# EAGLE design 0.1 (EAGLE 6.6.0)
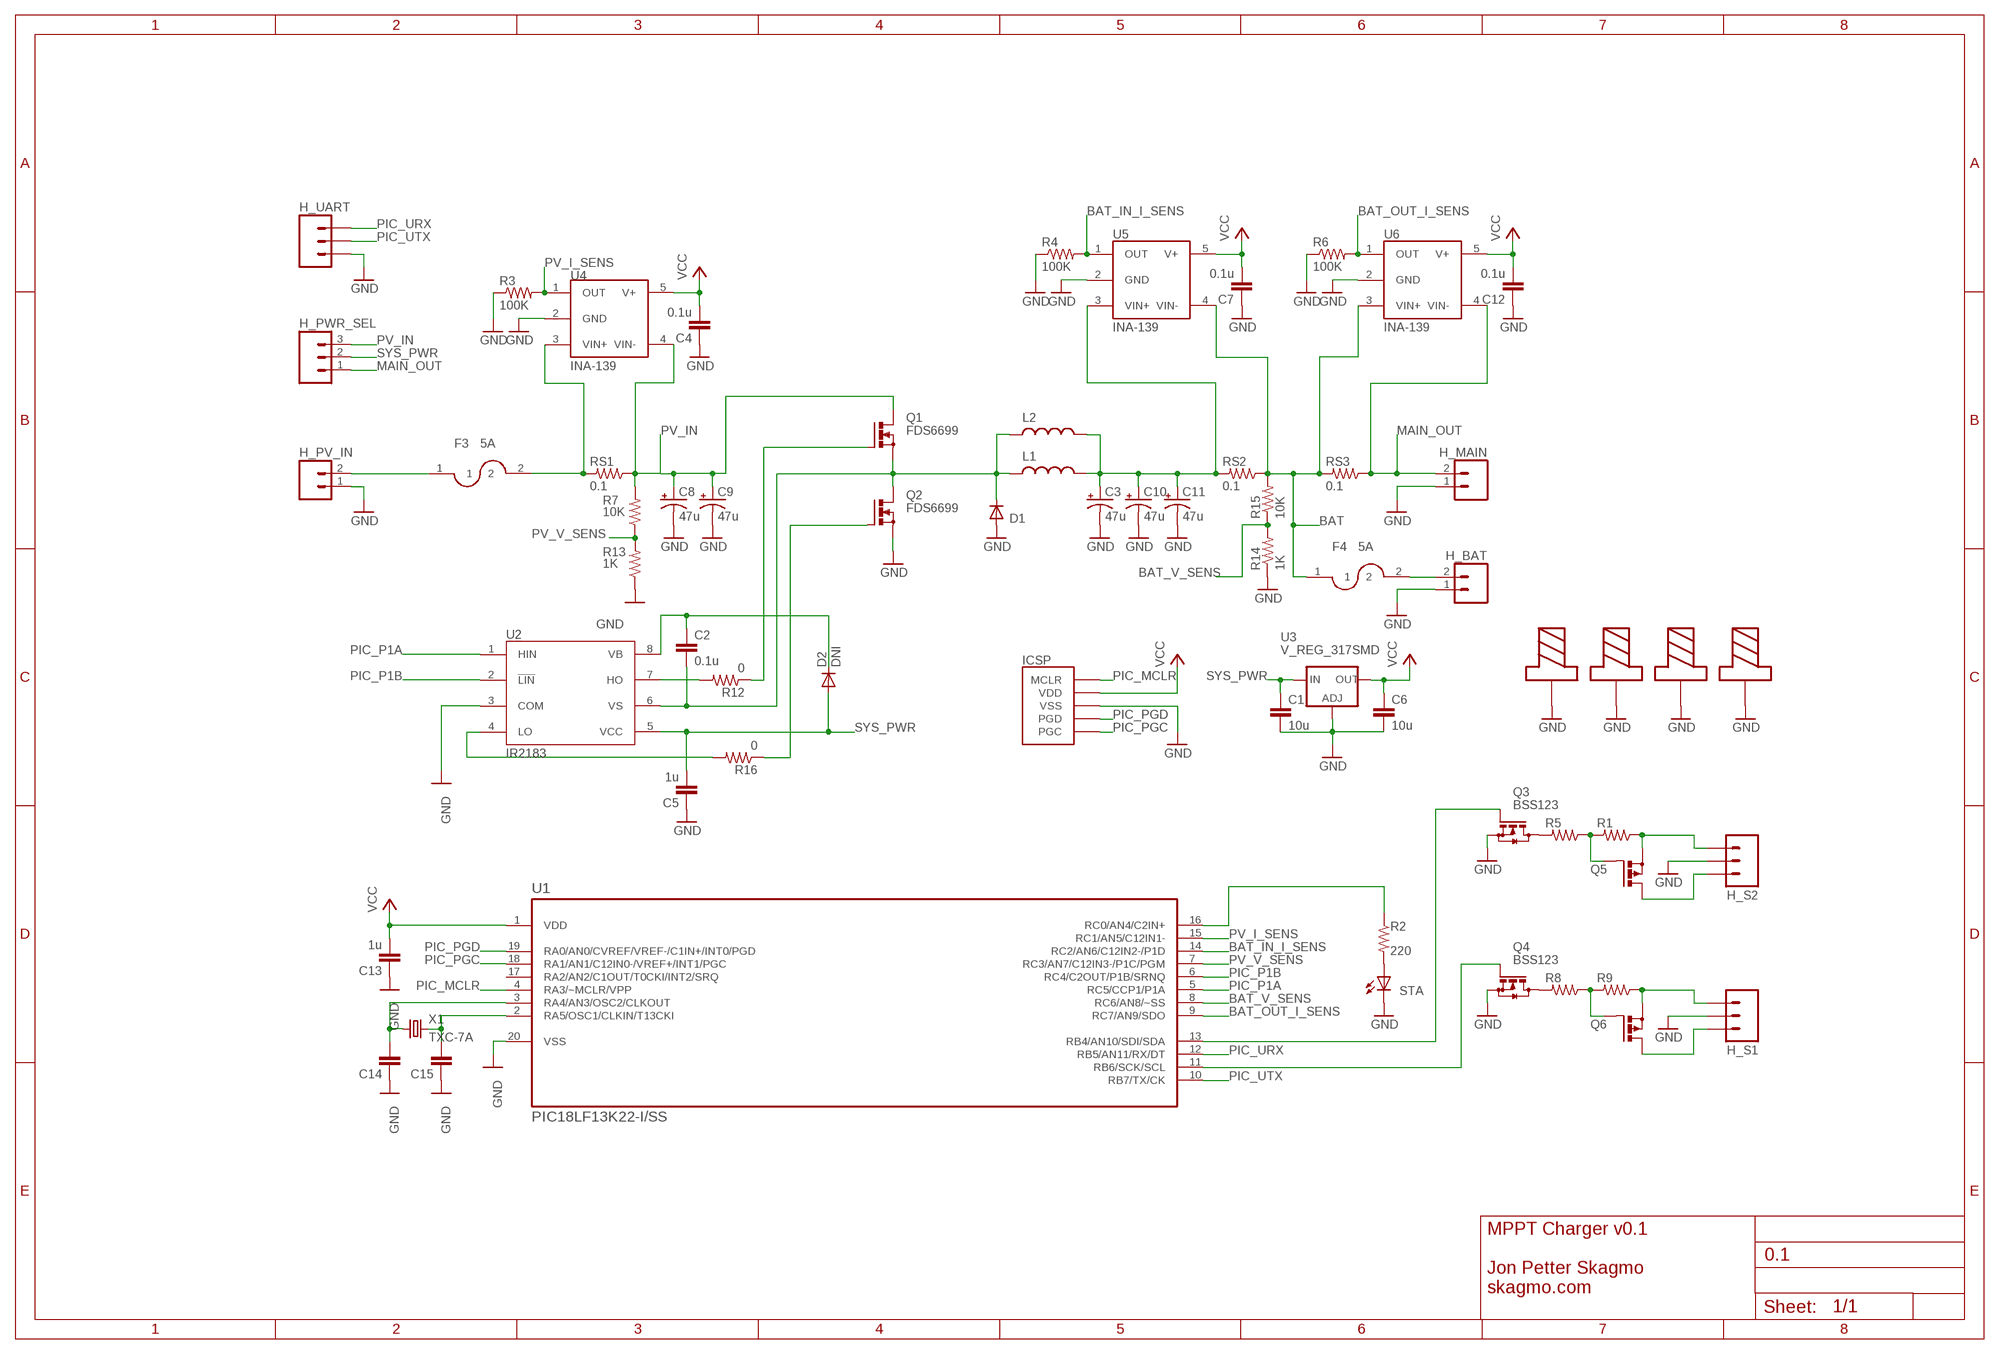
[diagram p0: schematic, sheet 1]

## Parts
C1  10u  C-EUC0805K  [C0805K]
C2  0.1u  CAP0603  [0603]
C3  47u  CAP_POLCT7343  [CT7343]
C4  0.1u  CAP0603  [0603]
C5  1u  CAP0603  [0603]
C6  10u  C-EUC0805K  [C0805K]
C7  0.1u  CAP0603  [0603]
C8  47u  CAP_POLCT7343  [CT7343]
C9  47u  CAP_POLCT7343  [CT7343]
C10  47u  CAP_POLCT7343  [CT7343]
C11  47u  CAP_POLCT7343  [CT7343]
C12  0.1u  CAP0603  [0603]
C13  1u  CAP0603  [0603]
C14  CAP0603  [0603]
C15  CAP0603  [0603]
D1  DIODESMB  [SMB-DIODE]
D2  DNI  DIODESOD  [SOD-323]
F3  5A  FUSE1206  [1206]
F4  5A  FUSE1206  [1206]
H_BAT  M023.5MM  [SCREWTERMINAL-3.5MM-2]
H_MAIN  M023.5MM  [SCREWTERMINAL-3.5MM-2]
H_PV_IN  M023.5MM  [SCREWTERMINAL-3.5MM-2]
H_PWR_SEL  M03PTH  [1X03]
H_S1  1X3SCREW  [1X3_SCREW_0.1]
H_S2  1X3SCREW  [1X3_SCREW_0.1]
H_UART  1X3SCREW  [1X3_SCREW_0.1]
ICSP  1X5_ICSP  [1X5_2MM]
L1  INDUCTORIHLP-6767  [IHLP-6767]
L2  INDUCTORIHLP-4040  [IHLP-4040]
Q1  FDS6699  PMOSFET_N  [SO08]
Q2  FDS6699  PMOSFET_N  [SO08]
Q3  BSS123  [SOT23]
Q4  BSS123  [SOT23]
Q5  PMOSFET_P  [SO08]
Q6  PMOSFET_P  [SO08]
R1  RESISTOR0603  [0603]
R2  220  RESISTOR0603  [0603]
R3  100K  RESISTOR0603  [0603]
R4  100K  RESISTOR0603  [0603]
R5  RESISTOR0603  [0603]
R6  100K  RESISTOR0603  [0603]
R7  10K  RESISTOR0603  [0603]
R8  RESISTOR0603  [0603]
R9  RESISTOR0603  [0603]
R12  0  RESISTOR0603  [0603]
R13  1K  RESISTOR0603  [0603]
R14  1K  RESISTOR0603  [0603]
R15  10K  RESISTOR0603  [0603]
R16  0  RESISTOR0603  [0603]
RS1  0.1  RESISTOR1206  [1206]
RS2  0.1  RESISTOR1206  [1206]
RS3  0.1  RESISTOR1206  [1206]
STA  LEDCHIPLED_0805  [CHIPLED_0805]
U1  PIC18LF13K22-I/SS  [SOP65P780X200-20N]
U2  IR2183  [SO08]
U3  V_REG_317SMD  [SOT223]
U4  INA-139  INA-169  [SOT23-5]
U5  INA-139  INA-169  [SOT23-5]
U6  INA-139  INA-169  [SOT23-5]
U$1  CORNER_SCREW  [CORNER_SCREW]
U$2  CORNER_SCREW  [CORNER_SCREW]
U$3  CORNER_SCREW  [CORNER_SCREW]
U$4  CORNER_SCREW  [CORNER_SCREW]
X1  TXC-7A  [TXC-7A]

## Nets
$N100: F3.1 H_PV_IN.2
$N145: F3.2 RS1.2 U4.3(VIN+)
BAT: F4.1 R15.2 RS2.1 RS3.2 U5.4(VIN-) U6.3(VIN+)
BAT_IN_I_SENS: R4.2 U1.14(RC2/AN6/C12IN2-/P1D) U5.1(OUT)
BAT_OUT_I_SENS: R6.2 U1.9(RC7/AN9/SDO) U6.1(OUT)
BAT_V_SENS: R14.2 R15.1 U1.8(RC6/AN8/~SS)
GND: C1.2 C3.- C4.1 C5.1 C6.2 C7.1 C8.- C9.- C10.- C11.- C12.1 C13.1 C14.1 C15.1 D1.A H_BAT.1 H_MAIN.1 H_PV_IN.1 H_S1.P$2 H_S2.P$2 H_UART.P$1 ICSP.P$3(VSS) Q2.1(S) Q2.2(S) Q2.3(S) Q3.2(S) Q4.2(S) R3.1 R4.1 R6.1 R13.1 R14.1 STA.C U1.20(VSS) U2.3(COM) U3.1(ADJ) U4.2(GND) U5.2(GND) U6.2(GND) U$1.P$1 U$2.P$1 U$3.P$1 U$4.P$1
MAIN_OUT: H_MAIN.2 H_PWR_SEL.1 RS3.1 U6.4(VIN-)
N$1: Q3.1(G) U1.13(RB4/AN10/SDI/SDA)
N$2: C2.2 D1.C L1.P$1 L2.1 Q1.1(S) Q1.2(S) Q1.3(S) Q2.5(D) Q2.6(D) Q2.7(D) Q2.8(D) U2.6(VS)
N$3: R12.2 U2.7(HO)
N$4: R16.2 U2.4(LO)
N$5: C3.+ C10.+ C11.+ L1.P$2 L2.2 RS2.2 U5.3(VIN+)
N$6: Q3.3(D) R5.2
N$7: Q5.4(G) R1.2 R5.1
N$8: Q4.3(D) R8.2
N$9: Q1.4(G) R12.1
N$10: R2.2 STA.A
N$11: Q2.4(G) R16.1
N$12: R2.1 U1.16(RC0/AN4/C2IN+)
N$13: F4.2 H_BAT.2
N$14: C14.2 U1.3(RA4/AN3/OSC2/CLKOUT) X1.1
N$15: Q6.4(G) R8.1 R9.2
N$16: C15.2 U1.2(RA5/OSC1/CLKIN/T13CKI) X1.2
N$17: C2.1 D2.1(C) U2.8(VB)
N$18: Q4.1(G) U1.11(RB6/SCK/SCL)
PIC_MCLR: ICSP.P$1(MCLR) U1.4(RA3/~MCLR/VPP)
PIC_P1A: U1.5(RC5/CCP1/P1A) U2.1(HIN)
PIC_P1B: U1.6(RC4/C2OUT/P1B/SRNQ) U2.2(!LIN)
PIC_PGC: ICSP.P$5(PGC) U1.18(RA1/AN1/C12IN0-/VREF+/INT1/PGC)
PIC_PGD: ICSP.P$4(PGD) U1.19(RA0/AN0/CVREF/VREF-/C1IN+/INT0/PGD)
PIC_URX: H_UART.P$3 U1.12(RB5/AN11/RX/DT)
PIC_UTX: H_UART.P$2 U1.10(RB7/TX/CK)
PV_I_SENS: R3.2 U1.15(RC1/AN5/C12IN1-) U4.1(OUT)
PV_IN: C8.+ C9.+ H_PWR_SEL.3 Q1.5(D) Q1.6(D) Q1.7(D) Q1.8(D) R7.2 RS1.1 U4.4(VIN-)
PV_V_SENS: R7.1 R13.2 U1.7(RC3/AN7/C12IN3-/P1C/PGM)
S0_IN: H_S2.P$1 Q5.1(S) Q5.2(S) Q5.3(S) R1.1
S0_OUT: H_S2.P$3 Q5.5(D) Q5.6(D) Q5.7(D) Q5.8(D)
S1_IN: H_S1.P$1 Q6.1(S) Q6.2(S) Q6.3(S) R9.1
S1_OUT: H_S1.P$3 Q6.5(D) Q6.6(D) Q6.7(D) Q6.8(D)
SYS_PWR: C1.1 C5.2 D2.2(A) H_PWR_SEL.2 U2.5(VCC) U3.3(IN)
VCC: C4.2 C6.1 C7.2 C12.2 C13.2 ICSP.P$2(VDD) U1.1(VDD) U3.2(OUT) U4.5(V+) U5.5(V+) U6.5(V+)
Unconnected: U1.17(RA2/AN2/C1OUT/T0CKI/INT2/SRQ)

## Notes on the sheet
- MPPT Charger v0.1
  
  Jon Petter Skagmo
  skagmo.com

## Library data of the parts
C1 C6 = rcl:C-EU: CAPACITOR, European symbol
C2 C4 C5 C7 C12-C15 = 01-eos-components:CAP: Capacitor Standard 0603 ceramic capacitor, and 0.1" leaded capacitor.
C3 C8-C11 = 03-vhf_sdr:CAP_POL: Capacitor Polarized These are standard SMD and PTH capacitors. Normally 10uF, 47uF, and 100uF in electrolytic and tantalum varieties. Always verify the external diameter of the through hole cap, it varies with capacity, voltage, and manufacturer. The EIA devices should be standard.
D1 = SparkFun:DIODE: Diode These are standard reverse protection diodes and small signal diodes. SMA package can handle up to about 1A. SOD-323 can handle about 200mA. What the SOD-323 package when ordering, there are some mfgs out there that are 5-pin packages.
D2 = 04-sparkfun:DIODE: Diode These are standard reverse protection diodes and small signal diodes. SMA package can handle up to about 1A. SOD-323 can handle about 200mA. What the SOD-323 package when ordering, there are some mfgs out there that are 5-pin packages.
F3 F4 = 01-eos-components:FUSE
H_BAT H_MAIN H_PV_IN = 04-sparkfun:M02: Header 2 Standard 2-pin 0.1" header. Use with straight break away headers (SKU : PRT-00116), right angle break away headers (PRT-00553), swiss pins (PRT-00743), machine pins (PRT-00117), and female headers (PRT-00115). Molex polarized connector foot print use with SKU : PRT-08233 with associated crimp pins and housings.
H_PWR_SEL = 04-sparkfun:M03: Header 3 Standard 3-pin 0.1" header. Use with straight break away headers (SKU : PRT-00116), right angle break away headers (PRT-00553), swiss pins (PRT-00743), machine pins (PRT-00117), and female headers (PRT-00115). Molex polarized connector foot print use with SKU : PRT-08232 with associated crimp pins and housings.
H_S1 H_S2 H_UART = 01-eos-components:1X3: Header 3 Standard 3-pin 0.1" header. Use with straight break away headers (SKU : PRT-00116), right angle break away headers (PRT-00553), swiss pins (PRT-00743), machine pins (PRT-00117), and female headers (PRT-00115). Molex polarized connector foot print use with SKU : PRT-08232 with associated crimp pins and housings.
ICSP = 01-eos-components:1X5_ICSP
L1 L2 = 01-eos-components:INDUCTOR: Inductors Basic Inductor/Choke - 0603 and 1206. Footprints are not proven and vary greatly between part numbers.
Q1 Q2 = 01-eos-components:PMOSFET_N: Power MOSFET N-Channel
Q3 Q4 = transistor-small-signal:BSS123: N-CHANNEL MOS FET
Q5 Q6 = 01-eos-components:PMOSFET_P: Power MOSFET P-Channel
R1-R9 R12-R16 RS1-RS3 = 01-eos-components:RESISTOR: Resistor Basic schematic elements and footprints for 0603, 1206, and PTH 1/10th watt (small) resistors.
STA = led:LED: LED OSRAM: - CHIPLED LG R971, LG N971, LY N971, LG Q971, LY Q971, LO R971, LY R971 LH N974, LH R974 LS Q976, LO Q976, LY Q976 LO Q996 - Hyper CHIPLED LW Q18S LB Q993, LB Q99A, LB R99A - SideLED LS A670, LO A670, LY A670, LG A670, LP A670 LB A673, LV A673, LT A673, LW A673 LH A674 LY A675 LS A676, LA A676, LO A676, LY A676, LW A676 LS A679, LY A679, LG A679 - Hyper Micro SIDELED® LS Y876, LA Y876, LO Y876, LY Y876 LT Y87S - SmartLED LW L88C, LW L88S LB L89C, LB L89S, LG L890 LS L89K, LO L89K, LY L89K LS L896, LA L896, LO L896, LY L896 - TOPLED LS T670, LO T670, LY T670, LG T670, LP T670 LSG T670, LSP T670, LSY T670, LOP T670, LYG T670 LG T671, LOG T671, LSG T671 LB T673, LV T673, LT T673, LW T673 LH T674 LS T676, LA T676, LO T676, LY T676, LB T676, LH T676, LSB T676, LW T676 LB T67C, LV T67C, LT T67C, LS T67K, LO T67K, LY T67K, LW E67C LS E67B, LA E67B, LO E67B, LY E67B, LB E67C, LV E67C, LT E67C LW T67C LS T679, LY T679, LG T679 LS T770, LO T770, LY T770, LG T770, LP T770 LB T773, LV T773, LT T773, LW T773 LH T774 LS E675, LA E675, LY E675, LS T675 LS T776, LA T776, LO T776, LY T776, LB T776 LHGB T686 LT T68C, LB T68C - Hyper Mini TOPLED® LB M676 - Mini TOPLED Santana® LG M470 LS M47K, LO M47K, LY M47K Source: http://www.osram.convergy.de LUXEON: - LUMILED® LXK2-PW12-R00, LXK2-PW12-S00, LXK2-PW14-U00, LXK2-PW14-V00 LXK2-PM12-R00, LXK2-PM12-S00, LXK2-PM14-U00 LXK2-PE12-Q00, LXK2-PE12-R00, LXK2-PE12-S00, LXK2-PE14-T00, LXK2-PE14-U00 LXK2-PB12-K00, LXK2-PB12-L00, LXK2-PB12-M00, LXK2-PB14-N00, LXK2-PB14-P00, LXK2-PB14-Q00 LXK2-PR12-L00, LXK2-PR12-M00, LXK2-PR14-Q00, LXK2-PR14-R00 LXK2-PD12-Q00, LXK2-PD12-R00, LXK2-PD12-S00 LXK2-PH12-R00, LXK2-PH12-S00 LXK2-PL12-P00, LXK2-PL12-Q00, LXK2-PL12-R00 Source: www.luxeon.com KINGBRIGHT: KA-3528ASYC Source: www.kingbright.com
U1 = 01-eos-components:PIC18LF13K22-I/SS: Flash Microcontrollers; MPN: PIC18LF13K22-I/SS; OC_FARNELL: 1770699; OC_NEWARK: 07P9697; PACKAGE: SOP-20; SUPPLIER: Microchip
U2 = 01-eos-components:IR2183
U3 = SparkFun:V_REG_317: Voltage Regulator Standard LM317 adjustable voltage regulator. AOI (Adjust Output Input). Google 'LM317 Calculator' for easy to use app to get the two resistor values needed. 240/720 for 5V output. 240/390 for 3.3V output. Spark Fun Electronics SKU : COM-00527
U4-U6 = 08-maritime-components:INA-169
U$1-U$4 = 01-eos-components:CORNER_SCREW
X1 = 00-mr-library:TXC-7A

## Board
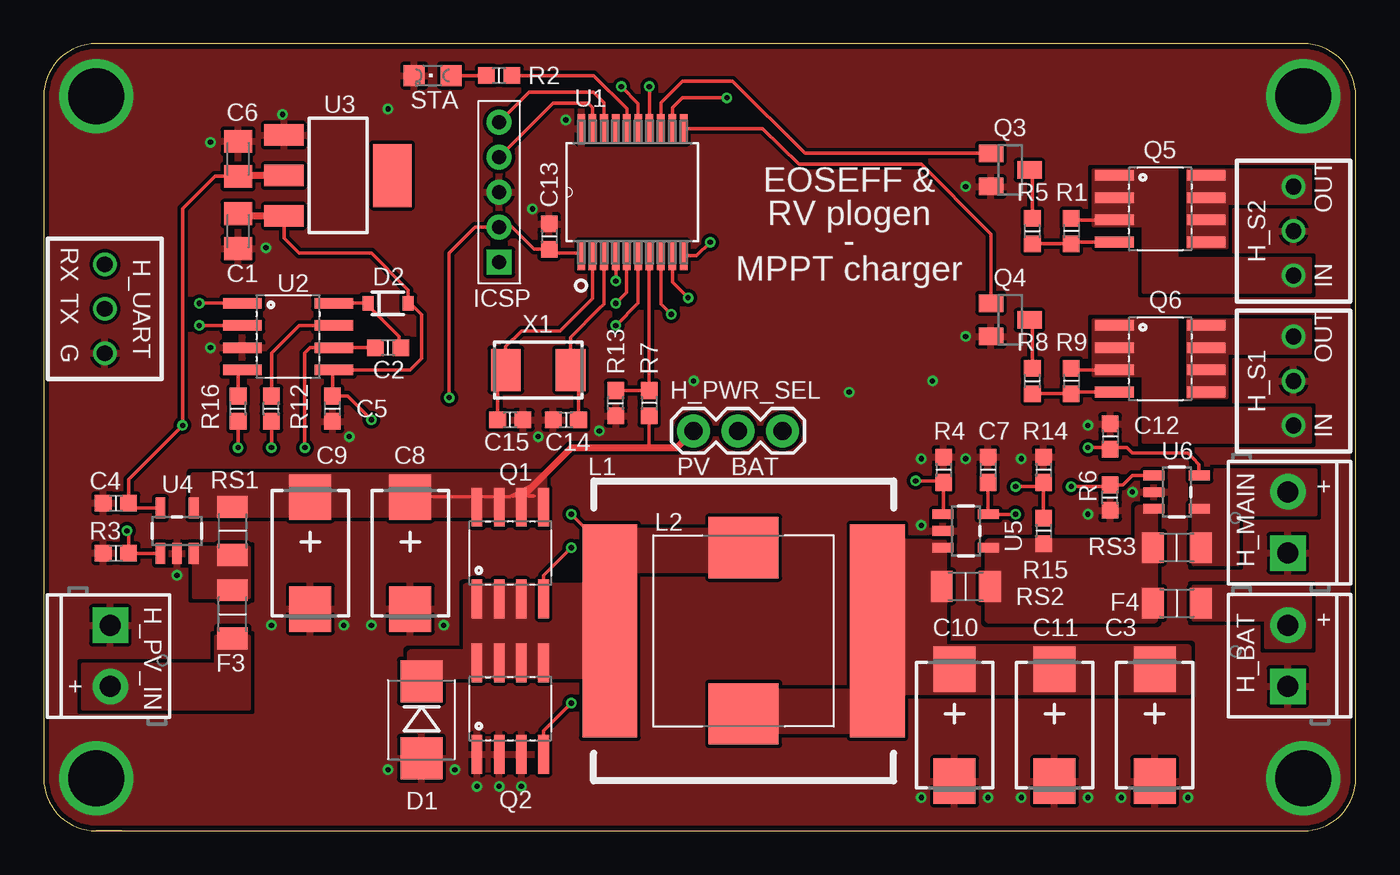
[diagram p1: board, top side]
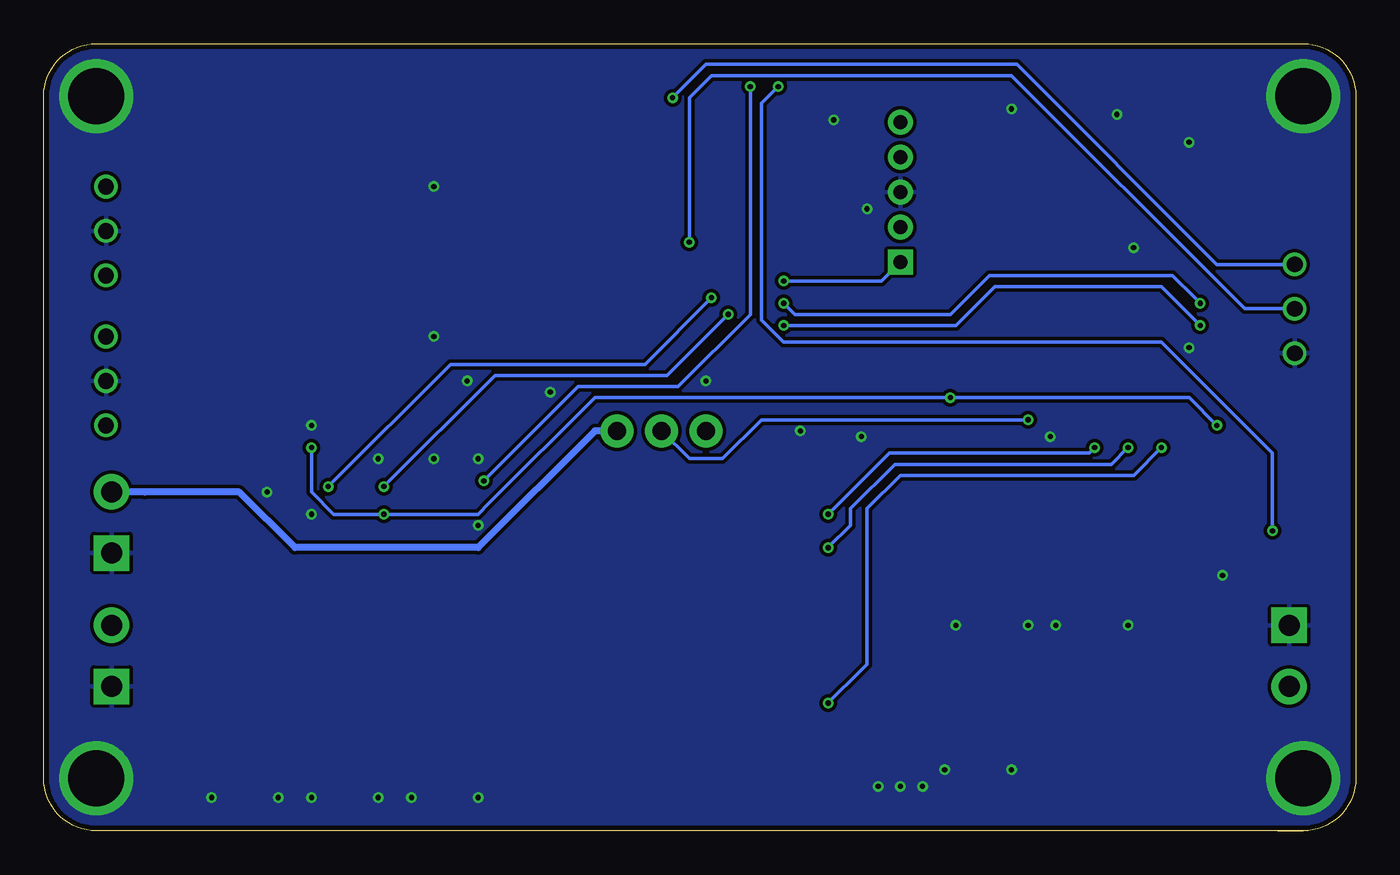
[diagram p2: board, bottom side, seen from below]

Size 75 x 45 mm. Coordinates in mm from the lower left corner, seen from the top.
Outline: 4.45,0 3,0
Outline: 3,0 4.45,0
Outline: 4.45,0 71,0 72,0 arc90 75,3 75,40 75,42 arc90 72,45 4,45 3,45 arc90 0,42 0,3 arc90 3,0
Outline: 3,0 4.45,0
Copper layers (1+2*15+16): Top 0.035mm / dielectric 0.2mm / Route2 0.035mm / dielectric 1mm / Route15 0.035mm / dielectric 0.2mm / Bottom 0.035mm
Design rules "mr_drc": minimum track width 0.2mm, minimum drill 0.3mm, track to track 0.2mm, track to pad 0.2mm, pad to pad 0.2mm, via to via 0.2mm, smd to smd 0.1mm, copper to edge 0.3mm, drill to drill 0.3mm, minimum pad ring 0.15mm, minimum via ring 0.15mm, stop-mask expansion 0.1mm, vias tented up to drill 0.8mm, thermal gap 0.2mm

### Footprints (pad centres in the part's own frame; a part is rotated, then mirrored left to right if it is on the bottom)
C0805K = smd 1.3 x 1.6: 1 -1,0; 2 1,0
0603 = smd 0.95 x 0.95: 1 -0.725,0; 2 0.725,0
CT7343 = smd 2.6 x 2.4: + 3.2,0; - -3.2,0
SMB-DIODE = smd 2.4 x 2.4: A 2.2,0; C -2.2,0
SOD-323 = smd 0.63 x 0.83: 1 -1.15,0; 2 1.15,0
1206 = smd 1.25 x 1.75: 1 -1.375,0; 2 1.375,0
SCREWTERMINAL-3.5MM-2 = drill 1.2 pad 2.032 square: 1 0,0 | drill 1.2 pad 2.032: 2 3.5,0
1X03 = drill 1.016 pad 1.88: 1 0,0; 2 2.54,0; 3 5.08,0
1X3_SCREW_0.1 = drill 0.9: P$1 -2.54,0; P$2 0,0; P$3 2.54,0
1X5_2MM = drill 0.8 pad 1.422 square: P$1 -4,0 | drill 0.8 pad 1.422: P$2 -2,0; P$3 0,0; P$4 2,0; P$5 4,0
IHLP-6767 = smd 3.125 x 12.19: P$1 -7.647,0; P$2 7.647,0
IHLP-4040 = smd 3.5 x 4: 1 -4.75,0; 2 4.75,0
SO08 = smd 0.61 x 2.21: 1 -1.905,-2.616; 2 -0.635,-2.616; 3 0.635,-2.616; 4 1.905,-2.616; 5 1.905,2.616; 6 0.635,2.616; 7 -0.635,2.616; 8 -1.905,2.616
SOT23 = smd 1 x 1.4: 1 -0.95,-1.1; 2 0.95,-1.1; 3 0,1.1
CHIPLED_0805 = smd 1.2 x 1.2: A 0,-1.05; C 0,1.05
SOP65P780X200-20N = smd 1.651 x 0.432: 1 -3.632,2.921; 2 -3.632,2.286; 3 -3.632,1.626; 4 -3.632,0.965; 5 -3.632,0.33; 6 -3.632,-0.33; 7 -3.632,-0.965; 8 -3.632,-1.626; 9 -3.632,-2.286; 10 -3.632,-2.921; 11 3.632,-2.921; 12 3.632,-2.286; 13 3.632,-1.626; 14 3.632,-0.965; 15 3.632,-0.33; 16 3.632,0.33; 17 3.632,0.965; 18 3.632,1.626; 19 3.632,2.286; 20 3.632,2.921
SOT223 = smd 1.219 x 2.235: 1 -2.311,-3.099; 2 0,-3.099; 3 2.311,-3.099 | smd 3.6 x 2.2: 4 0,3.099
SOT23-5 = smd 0.55 x 1.2: 1 -0.95,-1.3; 2 0,-1.3; 3 0.95,-1.3; 4 0.95,1.3; 5 -0.95,1.3
CORNER_SCREW = drill 3.2: P$1 3,3
TXC-7A = smd 1.7 x 2.4: 1 -1.85,0; 2 1.85,0

### Placement (x,y rotation side)
C1  [C0805K]  11.11,34.29 270 top
C2  19.68,27.62 180 top
C3  63.5,6.03 90 top
C4  [0603]  4.13,18.73 0 top
C5  16.51,24.13 90 top
C6  [C0805K]  11.11,38.42 90 top
C7  [0603]  53.98,20.64 270 top
C8  20.95,15.88 90 top
C9  15.24,15.88 90 top
C10  52.07,6.03 90 top
C11  57.78,6.03 90 top
C12  [0603]  60.96,22.54 270 top
C13  [0603]  28.89,33.97 270 top
C14  29.84,23.5 0 top
C15  26.67,23.5 180 top
D1  21.59,6.35 270 top
D2  19.68,30.16 0 top
F3  10.79,12.38 90 top
F4  64.77,13.02 0 top
H_BAT  71.12,8.26 90 top
H_MAIN  71.12,15.88 90 top
H_PV_IN  3.81,11.75 270 top
H_PWR_SEL  42.23,22.86 180 top
H_S1  71.44,25.72 90 top
H_S2  71.44,34.29 90 top
H_UART  3.49,29.84 90 top
ICSP  26.04,36.51 90 top
L1  40.01,11.43 0 top
L2  40.01,11.43 270 top
Q1  [SO08]  26.67,15.88 0 top
Q2  [SO08]  26.67,6.99 0 top
Q3  55.24,37.78 270 top
Q4  55.24,29.21 270 top
Q5  63.82,35.56 270 top
Q6  63.82,26.99 270 top
R1  58.74,34.29 270 top
R2  [0603]  26.04,43.18 180 top
R3  4.13,15.88 0 top
R4  51.44,20.64 270 top
R5  56.52,34.29 90 top
R6  60.96,19.05 90 top
R7  34.61,24.45 270 top
R8  56.52,25.72 90 top
R9  58.74,25.72 270 top
R12  [0603]  13.02,24.13 90 top
R13  32.7,24.45 90 top
R14  57.15,20.64 270 top
R15  57.15,17.14 270 top
R16  [0603]  11.11,24.13 90 top
RS1  10.79,17.14 270 top
RS2  52.7,13.97 180 top
RS3  64.77,16.19 180 top
STA  22.23,43.18 90 top
U1  33.66,36.51 90 top
U2  13.97,28.26 270 top
U3  16.83,37.47 270 top
U4  7.62,17.14 0 top
U5  52.7,17.14 270 top
U6  64.77,19.37 270 top
U$1  0,0 0 top
U$2  75,0 90 top
U$3  75,45 180 top
U$4  0,45 270 top
X1  28.26,26.35 180 top

### Tracks (layer width: path | path; a pad name or v marks a point on that pad's centre or on a via)
$N100
  pour Top (no thermals): 2.22,9.53 9.84,9.53 9.84,11.11 11.75,11.11 11.75,6.99 2.22,6.99
$N145
  pour Top (no thermals): 8.57,16.19 8.57,13.34 11.75,13.34 11.75,16.19
BAT
  pour Top (no thermals): 53.98,12.06 63.5,12.06 63.5,18.41 62.55,18.41 62.55,16.51 53.98,16.51
BAT_IN_I_SENS  (via drill 0.3)
  Top 0.2: 51.34,18.16 U5.1 51.44,18.12 R4.2 51.34,20 v49.85,20 | U1.14 34.62,40.34 34.62,42.53 v34.61,42.55
  Bottom 0.2: v49.85,20 44.45,25.4 38.73,25.4 34.61,29.53 v34.61,42.55
BAT_OUT_I_SENS  (via drill 0.3)
  Top 0.2: v36.83,30.48 35.94,31.37 U1.9 | v58.74,19.68 60.55,19.68 R6.2 61.69,19.77 62.23,20.32 U6.1
  Bottom 0.2: v58.74,19.68 51.75,26.67 40.64,26.67 v36.83,30.48
BAT_V_SENS  (via drill 0.3)
  Top 0.2: R15.1 R14.2 57.06,19.68 v55.56,19.68 | v35.88,29.53 35.28,30.12 U1.8
  Bottom 0.2: v55.56,19.68 49.21,26.04 39.37,26.04 36.2,29.21 v35.88,29.53
GND  (via drill 0.3)
  other vias: 50.16,1.91 53.98,1.91 55.88,1.91 59.69,1.91 61.59,1.91 65.41,1.91 27.3,2.54 26.04,2.54 24.77,2.54 23.5,3.49 19.68,3.49 22.86,11.75 18.73,11.75 17.14,11.75 13.02,11.75 31.75,22.86 17.46,22.54 9.53,27.62 12.7,33.34 9.53,39.37 13.65,40.96 19.68,41.27 29.84,40.64 52.7,36.83 52.7,28.26 59.69,23.18 50.16,21.27 52.7,21.27 55.88,21.27 50.8,25.72 46.04,25.08 59.69,18.1 62.23,19.37 50.16,17.46 7.62,14.61 27.94,35.56 28.26,22.54 37.15,25.72
  pour Top (rank 2): -0.64,-0.64 75.56,-0.64 75.56,45.09 -0.64,45.09
  pour Bottom: -2,-2 77,-2 77,47 -2,47
MAIN_OUT
  Bottom 0.406: H_PWR_SEL.1 43.5,22.86 50.16,16.19 60.64,16.19 63.82,19.37 69.21,19.37 H_MAIN.2
  pour Top (no thermals): 65.72,15.24 68.26,15.24 68.26,18.1 72.71,18.1 72.71,20.64 65.72,20.64
N$1
  Top 0.2: U1.13 35.28,41.63 36.51,42.86 39.37,42.86 43.5,38.73 Q3.1
N$2  (via drill 0.3)
  Top 0.2: C2.2 U2.6 15.24,27.62 14.92,27.3 14.92,25.72 14.92,25.08 v14.92,21.91 | v30.16,18.1 31.43,16.83 | 31.43,16.83 31.75,16.83 | 31.43,16.83 32.36,15.9 L1.P$1
  Top 2.184: 32.78,16.33 32.36,15.9
  Bottom 0.2: v30.16,18.1 26.67,21.59 22.54,21.59 15.24,21.59 v14.92,21.91
  pour Top (no thermals): 20.95,8.89 33.02,8.89 33.02,13.97 24.13,13.97 24.13,10.16 20.95,10.16
  pour Top (no thermals): 32.38,17.14 40.32,17.14 40.32,14.92 32.38,14.92
N$3
  Top 0.2: U2.7 15.24,28.89 14.61,28.89 13.02,27.3 R12.2
N$4
  Top 0.2: U2.4 11.11,26.35 11.11,24.99 R16.2
N$5
  Top 2.184: 47.49,6.53 47.62,6.67 47.62,11.4 L1.P$2
  pour Top (no thermals): 47.62,7.94 47.62,16.51 51.44,16.51 51.44,10.48 65.41,10.48 65.41,7.94
  pour Top (no thermals): 47.62,5.71 39.69,5.71 39.69,7.94 47.62,7.94
N$6
  Top 0.2: R5.2 56.52,37.61 Q3.3
N$7
  Top 0.2: R5.1 R1.2 58.83,33.66 Q5.4
N$8
  Top 0.2: R8.2 56.52,29.04 Q4.3
N$9  (via drill 0.3)
  Top 0.2: R12.1 v13.02,21.91 | 28.57,14.61 28.73,14.76 | 28.73,14.76 29.21,15.24 v30.16,16.19 | Q1.4 28.57,14.61 | 28.57,14.61 28.73,14.76
  Bottom 0.2: v13.02,21.91 13.97,20.95 26.35,20.95 28.89,18.41 28.89,17.46 v30.16,16.19
N$10
  Top 0.2: R2.2 STA.A
N$11  (via drill 0.3)
  Top 0.2: R16.1 v11.11,21.91 | v30.16,7.3 29.21,6.35 28.57,5.71 Q2.4
  Bottom 0.2: v11.11,21.91 12.7,20.32 26.04,20.32 27.94,18.41 27.94,9.53 28.26,9.21 v30.16,7.3
N$12
  Top 0.2: R2.1 31.43,43.18 33.34,41.27 33.34,40.16 U1.16
N$13
  pour Top (no thermals): 65.72,12.06 69.85,12.06 69.85,10.48 72.39,10.48 72.39,13.97 65.72,13.97
N$14
  Top 0.2: C14.2 30.57,25.57 X1.1 30.11,28.2 31.75,29.84 32.03,30.12 U1.3
N$15
  Top 0.2: Q6.4 58.83,25.08 R9.2 R8.1
N$16
  Top 0.2: C15.2 25.95,25.57 X1.2 26.41,27.68 27.3,28.57 29.53,28.57 31.11,30.16 31.37,30.42 U1.2
N$17
  Top 0.2: U2.8 D2.1 18.54,30.04 20.32,28.26 20.32,27.71 C2.1
N$18
  Top 0.2: U1.11 41.1,40.15 43.18,38.1 50.16,38.1 53.98,34.29 54.15,34.12 Q4.1
PIC_MCLR  (via drill 0.3)
  Top 0.2: U1.4 32.7,32.87 v32.7,31.43
  Bottom 0.2: v32.7,31.43 27.11,31.43 ICSP.P$1
PIC_P1A  (via drill 0.3)
  Top 0.2: U1.5 33.33,30.79 v32.7,30.16 | v8.89,30.16 U2.1
  Bottom 0.2: v32.7,30.16 32.07,29.53 23.18,29.53 20.95,31.75 10.48,31.75 9.21,30.48 v8.89,30.16
PIC_P1B  (via drill 0.3)
  Top 0.2: U1.6 33.98,30.18 v32.7,28.89 | v8.89,28.89 U2.2
  Bottom 0.2: v32.7,28.89 22.86,28.89 22.23,29.53 20.64,31.11 11.11,31.11 v8.89,28.89
PIC_PGC
  Top 0.2: U1.18 32.03,41.63 31.43,42.23 27.75,42.23 ICSP.P$5
PIC_PGD
  Top 0.2: U1.19 31.37,41.34 31.11,41.59 29.21,41.59 29.11,41.59 ICSP.P$4
PIC_URX  (via drill 0.3)
  Top 0.2: v39.05,41.91 36.51,41.91 35.94,41.34 U1.12
  Bottom 0.2: v39.05,41.91 37.15,43.81 19.37,43.81 7.94,32.38 H_UART.P$3
PIC_UTX  (via drill 0.3)
  Top 0.2: U1.10 37.33,32.88 v38.1,33.66
  Bottom 0.2: v38.1,33.66 38.1,41.91 36.83,43.18 19.68,43.18 6.99,30.48 6.35,29.84 H_UART.P$2
PV_I_SENS  (via drill 0.3)
  Top 0.2: U4.1 4.88,15.85 R3.2 4.85,17.05 v4.76,17.14 | v33.02,42.55 33.98,41.58 U1.15
  Bottom 0.2: v4.76,17.14 4.76,21.59 11.11,27.94 21.27,27.94 32.38,27.94 32.7,27.94 33.97,29.21 33.97,41.59 v33.02,42.55
PV_IN
  Top 0.2: 26.66,19.12 28.03,19.14 27.39,19.14 | 26.66,19.12 C8.+ | 27.94,19.76 26.66,19.12 | R7.2 34.61,21.91
  Top 0.406: 27.39,19.14 28.66,20.41 30.16,21.91 34.61,21.91 36.2,21.91 H_PWR_SEL.3
  pour Top (no thermals): 28.57,18.1 8.57,18.1 8.57,20.32 28.57,20.32
PV_V_SENS
  Top 0.2: U1.7 34.61,32.87 34.61,25.49 R7.1 R13.2
S0_IN
  Top 0.2: Q5.3 58.83,34.92 R1.1
  pour Top (no thermals): 60.01,37.78 64.77,37.78 64.77,32.7 72.39,32.7 72.39,30.8 62.87,30.8 62.87,34.61 60.01,34.61
S0_OUT
  pour Top (no thermals): 72.39,35.88 67.63,35.88 67.63,33.34 65.41,33.34 65.41,37.78 72.39,37.78
S1_IN
  Top 0.2: Q6.3 58.83,26.35 R9.1
  pour Top (no thermals): 60.01,29.21 64.77,29.21 64.77,24.13 72.39,24.13 72.39,22.23 62.87,22.23 62.87,26.04 60.01,26.04
S1_OUT
  pour Top (no thermals): 72.39,27.3 67.63,27.3 67.63,24.77 65.41,24.77 65.41,29.21 72.39,29.21
SYS_PWR  (via drill 0.3)
  Top 0.2: 17.14,26.35 U2.5 16.51,26.43 C5.2 17.37,24.86 v18.73,23.5 | 17.14,26.35 20.95,26.35 21.59,26.99 21.59,29.53 20.95,30.16 D2.2 20.84,30.92 20.64,31.11 18.73,33.02 14.61,33.02 13.73,33.9 U3.3 | 17.05,26.26 17.14,26.35
  Top 0.406: U3.3 11.25,35.15 C1.1
  Bottom 0.2: H_PWR_SEL.2 38.1,21.27 36.2,21.27 33.97,23.5 v18.73,23.5
VCC  (via drill 0.3)  (1 unrouted)
  Top 0.2: U4.5 5.14,18.45 C4.2 4.85,20.09 v7.94,23.18 7.94,25.08 7.94,35.56 9.79,37.42 C6.1 | C7.2 53.98,18.12 U5.5 v55.56,18.09 | v23.18,24.77 23.18,33.02 24.67,34.51 ICSP.P$2 26.77,34.51 28.03,33.25 C13.2 29.12,33.02 30.8,33.02 30.73,32.96 U1.1 | U6.5 66.04,20.32 66.04,20.95 65.72,21.27 65.41,21.59 62.23,21.59 61.91,21.91 60.73,21.91 C12.2 60.87,21.91 v59.69,21.91
  Top 0.406: U3.2 11.16,37.47 C6.1
  Bottom 0.2: v55.56,18.09 50.17,18.09 49.53,18.73 43.5,24.77 23.5,24.77 | 23.5,24.77 v23.18,24.77 | v23.18,24.77 9.53,24.77 v7.94,23.18 | v23.18,24.77 23.5,24.77 | v55.56,18.1 58.42,18.1 59.69,19.37 59.69,20 59.69,21.27 v59.69,21.91

### Text on the board
_tsilk: EOSEFF & | OUT | RV plogen | - | RX | IN | MPPT charger | TX | OUT | G | IN | PV BAT | + | + | +